# Altium schematic sheet PAGE2 - LED, RCV.SchDoc
size A3; DocumentNumber: 2; SheetNumber: 2; SheetTotal: 2
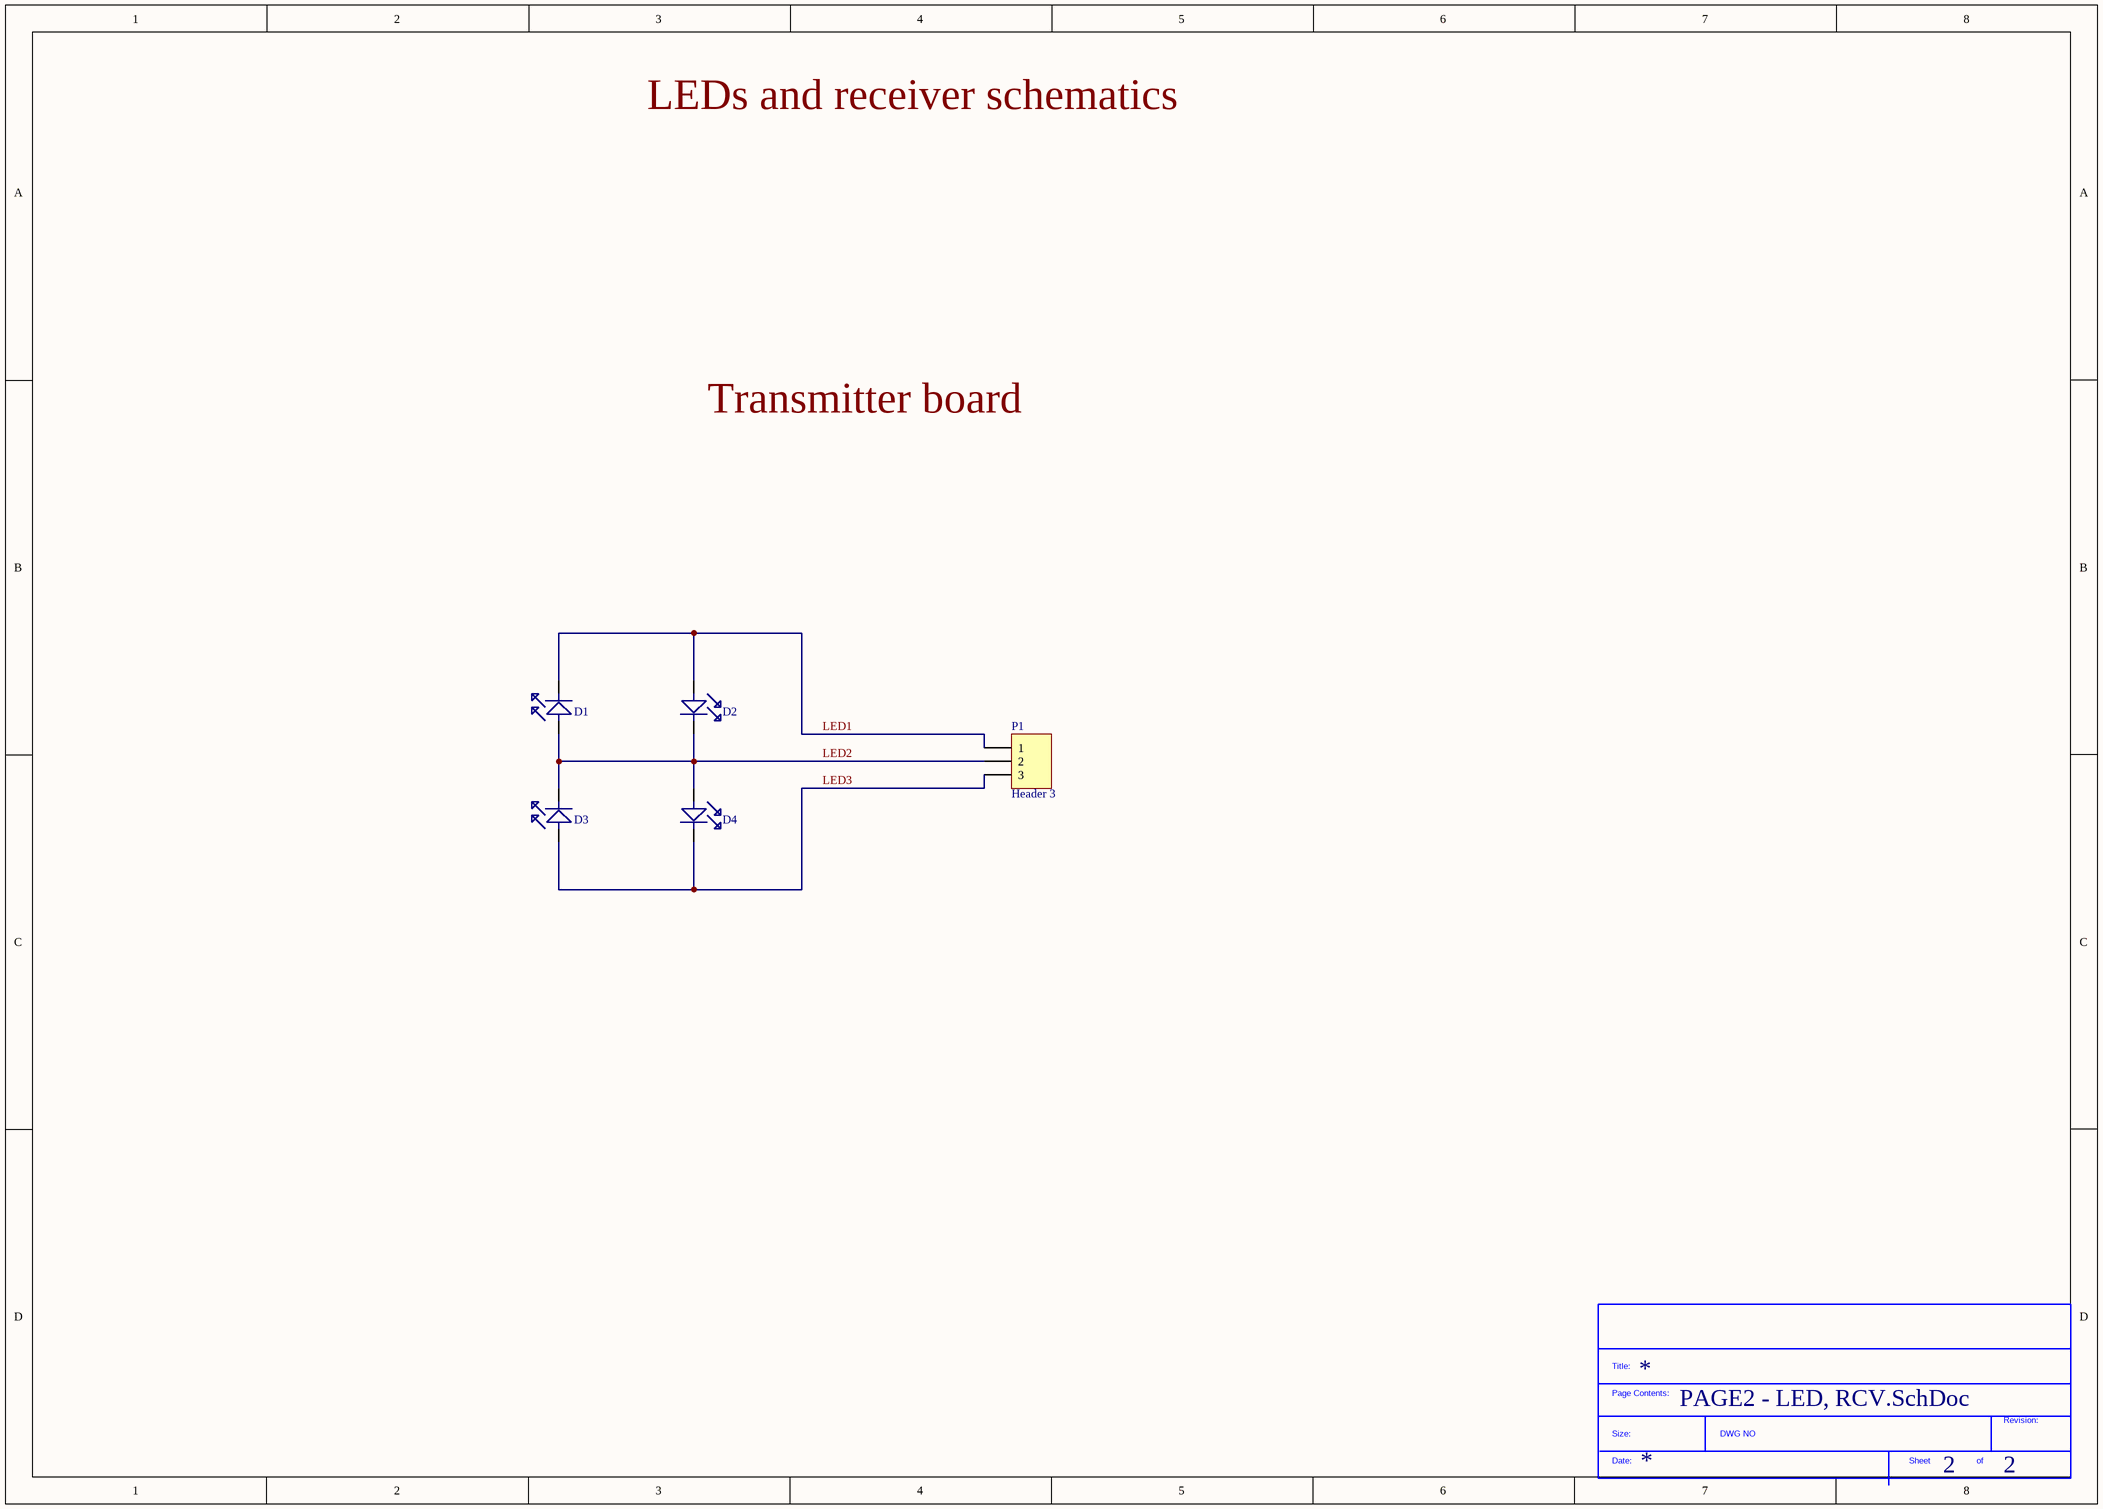
[diagram p0: PAGE2 - LED, RCV.SchDoc]

## Parts
*?  SDTitleBlock  (value not drawn)  (graphical)
D1  598-8030-107F  [LED0603]  (value not drawn)
D2  SML-LX0603SRW-TR  [LED0603]  (value not drawn)
D3  APT1608F3C  [LED0603]  (value not drawn)
D4  SML-LX0603SYW-TR  [LED0603]  (value not drawn)
P1  Header 3  [HDR1X3]

## Nets
LED1: D1.2 D2.1 P1.1
LED2: D1.1 D2.2 D3.2 D4.1 P1.2
LED3: D3.1 D4.2 P1.3

## Notes on the sheet
- LEDs and receiver schematics
- Transmitter board
- (in symbol SDTitleBlock) Title:; Page Contents:; Revision:; Size:; DWG NO; Date:; Sheet; of

## Library data of the parts
D1 = 598-8030-107F: Standard LEDs - SMD Orange Water Clr 150mcd 610nm; Manufacturer: Dialight; Lens Colour/Style: Water Clear; Wavelength: 600 nm to 610 nm; Lens Shape: Rectangular; Luminous Intensity: 70 mcd to 150 mcd; Viewing Angle: 140 deg; If - Forward Current: 20 mA; Vf - Forward Voltage: 1.7 V; Supplier 1: Mouser; Manufacturer Part Number: 598-8030-107F; RoHS: RoHS Compliant; Category: Standard LEDs - SMD; Stock 1: 11067; Pricing 1: 1=0.357, 10=0.210, 100=0.121, 1000=0.094, 4000=0.081, 8000=0.074, 24000=0.069, 48000=0.063, 100000=0.062 (EUR); Height: 0.7 mm; Illumination Colour: Orange; Length: 1.6 mm; Orientation: Top View; Package/Case: 0603 (1608 metric); Packaging: Reel; Width: 0.8 mm; Brand: Dialight; Mounting Style: SMD/SMT; Colour Temperature: -; Lens Dimensions: 1.1 mm x 0.8 mm; Maximum Operating Temperature: + 85 C; Minimum Operating Temperature: - 30 C; Standard Pack Qty: 4000; Wavelength/Colour Temperature: 600 nm to 610 nm; RoHS - Mouser: Y; Minimum Order Quantity: 1; Reeling: True; ComponentLink1URL: http://www.mouser.com/ds/2/109/SMT_selector_guide-267443.pdf; ComponentLink1Description: http://www.mouser.com/ds/2/109/SMT_selector_guide-267443.pdf; Supplier Part Number 1: 645-598-8030-107F
D2 = SML-LX0603SRW-TR: Standard LEDs - SMD Super Red, 660nm 1.7V, 45mcd; Manufacturer: Lumex; Lens Colour/Style: Milky White Diffused; Lens Shape: Rectangular; Viewing Angle: 140 deg; If - Forward Current: 20 mA; Supplier 1: Mouser; Manufacturer Part Number: SML-LX0603SRW-TR; RoHS: RoHS Compliant; Category: Standard LEDs - SMD; Stock 1: 29046; Pricing 1: 1=0.281, 10=0.171, 100=0.107, 500=0.078, 1000=0.061, 2000=0.060, 4000=0.054, 8000=0.048, 24000=0.043 (EUR); Illumination Colour: Red; Length: 1.6 mm; Package/Case: 0603 (1608 metric); Packaging: Reel; Wavelength: 660 nm; Width: 0.8 mm; Brand: Lumex; Luminous Intensity: 45 mcd; Mounting Style: SMD/SMT; Colour Temperature: -; Maximum Operating Temperature: + 85 C; Minimum Operating Temperature: - 25 C; Standard Pack Qty: 4000; Vf - Forward Voltage: 1.7 V; Wavelength/Colour Temperature: 660 nm; RoHS - Mouser: Y; Minimum Order Quantity: 1; Reeling: True; ComponentLink1URL: http://www.mouser.com/ds/2/244/SML-LX0603SRW-TR-1135914.pdf; ComponentLink1Description: http://www.mouser.com/ds/2/244/SML-LX0603SRW-TR-1135914.pdf; Supplier Part Number 1: 696-SML-LX0603SRW
D3 = APT1608F3C: Infrared Emitters IR 940nm 120 deg Water Clr 1.2 mW/sr; Manufacturer: Kingbright; Power Rating: 80 mW; Beam Angle: 120 deg; Lens Shape: Rectangular; If - Forward Current: 20 mA; Vf - Forward Voltage: 1.2 V; Vr - Reverse Voltage: 5 V; Supplier 1: Mouser; Manufacturer Part Number: APT1608F3C; RoHS: RoHS Compliant; Category: Infrared Emitters; Stock 1: 9952; Pricing 1: 1=0.221, 10=0.137, 100=0.102, 1000=0.083, 2000=0.075, 10000=0.068, 24000=0.061, 50000=0.058, 100000=0.055 (EUR); Height: 0.75 mm; Illumination Colour: Infrared; Length: 1.6 mm; Package/Case: 0603; Packaging: Reel; Wavelength: 940 nm; Width: 0.8 mm; Brand: Kingbright; Mounting Style: SMD/SMT; Viewing Angle: 120 deg; Lens Dimensions: 1.2 mm x 0.8 mm; Maximum Operating Temperature: + 85 C; Minimum Operating Temperature: - 40 C; Radiant Intensity: 1.2 mW/sr; Standard Pack Qty: 2000; RoHS - Mouser: Y; Minimum Order Quantity: 1; Reeling: True; ComponentLink1URL: http://www.mouser.com/ds/2/216/APT1608F3C-80735.pdf; ComponentLink1Description: http://www.mouser.com/ds/2/216/APT1608F3C-80735.pdf; Supplier Part Number 1: 604-APT1608F3C
D4 = SML-LX0603SYW-TR: Standard LEDs - SMD Super Yellow, 590nm 2V, 60mcd; Manufacturer: Lumex; Lens Colour/Style: White Diffused; Power Rating: 50 mW; Lens Shape: Rectangular; Viewing Angle: 140 deg; If - Forward Current: 20 mA; Vr - Reverse Voltage: 5 V; Supplier 1: Mouser; Manufacturer Part Number: SML-LX0603SYW-TR; RoHS: RoHS Compliant; Category: Standard LEDs - SMD; Stock 1: 11431; Pricing 1: 1=0.434, 10=0.283, 100=0.218, 500=0.187, 1000=0.145, 2000=0.119, 4000=0.111, 8000=0.107, 24000=0.105 (EUR); Height: 0.6 mm; Illumination Colour: Yellow; Length: 1.6 mm; Package/Case: 0603 (1608 metric); Packaging: Reel; Wavelength: 590 nm; Width: 0.8 mm; Brand: Lumex; Luminous Intensity: 60 mcd; Mounting Style: SMD/SMT; Peak Wavelength: 590 nm; Colour Temperature: -; Lens Dimensions: 1 mm x 0.8 mm; Maximum Operating Temperature: + 85 C; Minimum Operating Temperature: - 25 C; Standard Pack Qty: 4000; Vf - Forward Voltage: 2 V; Wavelength/Colour Temperature: 590 nm; RoHS - Mouser: Y; Minimum Order Quantity: 1; Reeling: True; ComponentLink1URL: http://www.mouser.com/ds/2/244/SML-LX0603SYW-TR-1136026.pdf; ComponentLink1Description: http://www.mouser.com/ds/2/244/SML-LX0603SYW-TR-1136026.pdf; Supplier Part Number 1: 696-SML-LX0603SYW
P1 = Header 3: Header, 3-Pin; LatestRevisionDate: 17-Jul-2002; LatestRevisionNote: Re-released for DXP Platform.; Publisher: Altium Limited